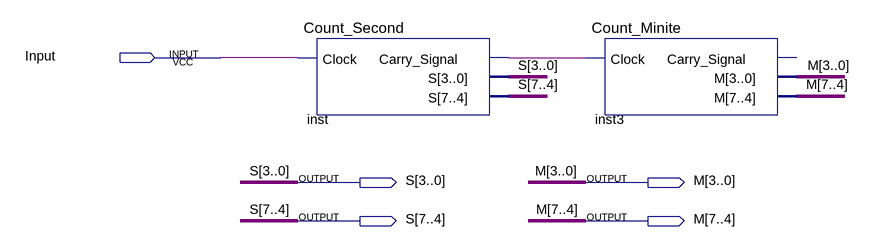
[diagram p0: schematic sheet]
// Quartus schematic TimingModule_Second_Minute.bdf as structural Verilog: 2 symbols, 5 pins
module TimingModule_Second_Minute (
  input  Input,
  output [7:0] S,
  output [7:0] M
);

  wire inst_carry_signal;

  Count_Second inst (.Clock(Input), .Carry_Signal(inst_carry_signal), .S(S));
  Count_Minite inst3 (.Clock(inst_carry_signal), .M(M));  // open: Carry_Signal
endmodule
